# EasyEDA schematic 1-Schematic_DAQ_circuit.json
TITLE: DAQ v2; REV: 1.0; Date: 2024-11-01; Sheet: 1/1; Drawn By: Shadman Shakib; Company: MAIM Lab
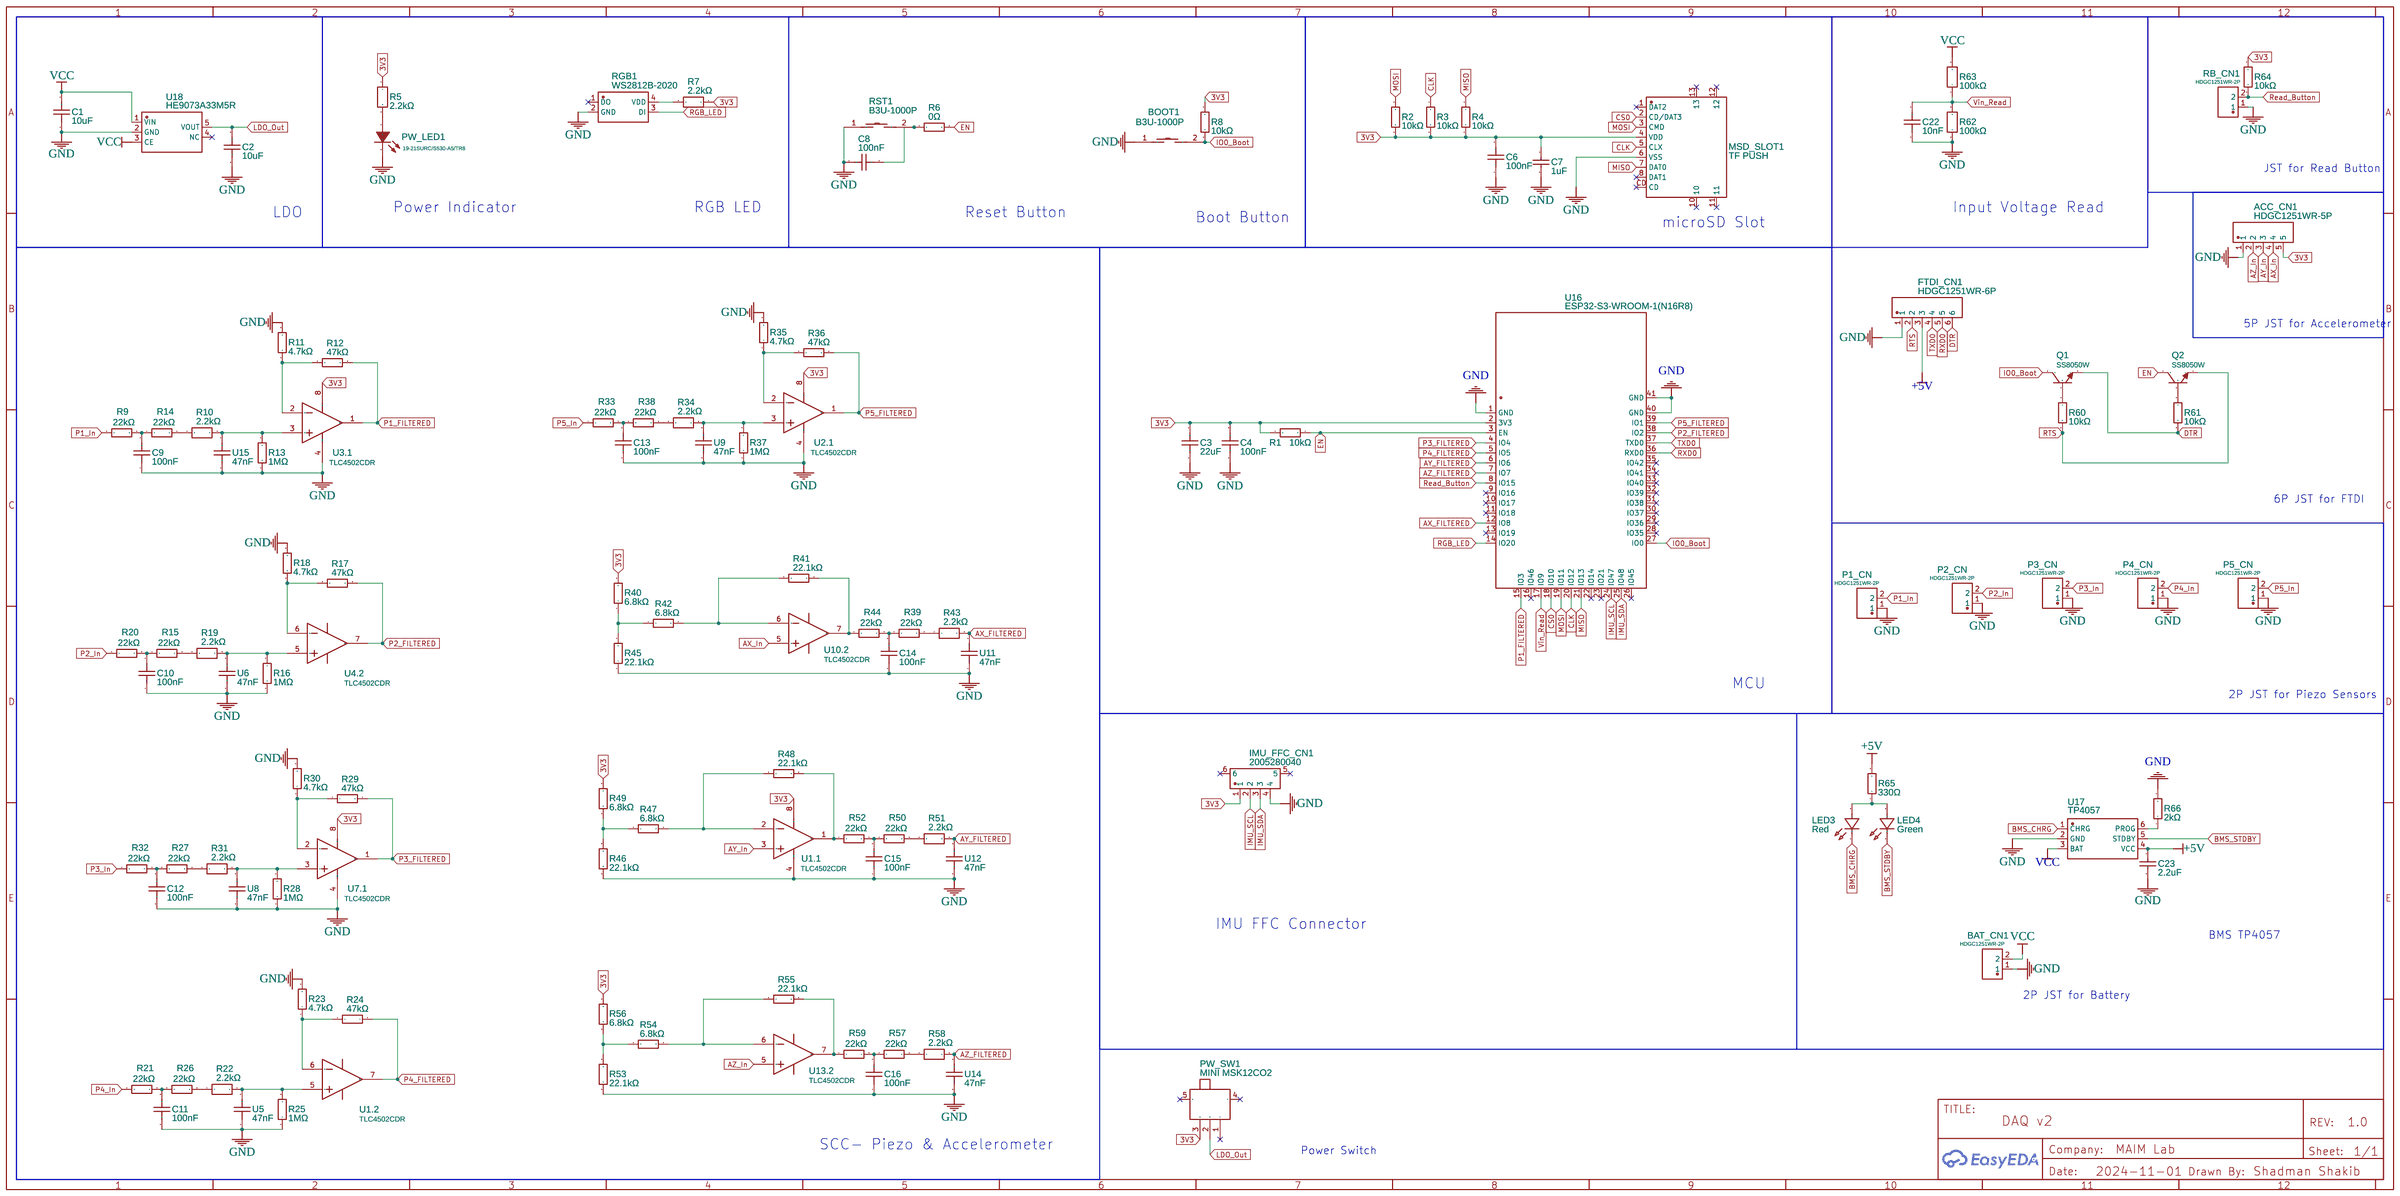
[diagram p0: schematic sheet]

## Parts
ACC_CN1  HDGC1251WR-5P  [CONN-TH_5P-P1.25_HDGC1251WR-5P]
BAT_CN1  HDGC1251WR-2P  [CONN-TH_2P-P1.25_HDGC1251WR-2P]
BOOT1  B3U-1000P  [KEY-SMD_B3U-1000PM]
C1  10uF  [C0402]
C2  10uF  [C0402]
C3  22uF  [C0402]
C4  100nF  [C0402]
C6  100nF  [C0402]
C7  1uF  [C0402]
C8  100nF  [C0402]
C9  100nF  [C0402]
C10  100nF  [C0402]
C11  100nF  [C0402]
C12  100nF  [C0402]
C13  100nF  [C0402]
C14  100nF  [C0402]
C15  100nF  [C0402]
C16  100nF  [C0402]
C22  10nF  [C0402]
C23  2.2uF  [C0402]
FTDI_CN1  HDGC1251WR-6P  [CONN-TH_6P-P1.25_HDGC1251WR-6P]
IMU_FFC_CN1  2005280040  [CONN-SMD_4P-P1.00_2005280040]
LED3  Red  [LED0603-RD_RED]
LED4  Green  [LED0603-RD_GREEN]
MSD_SLOT1  TF PUSH  [TF-SMD_TF-PUSH]
P1_CN  HDGC1251WR-2P  [CONN-TH_2P-P1.25_HDGC1251WR-2P]
P2_CN  HDGC1251WR-2P  [CONN-TH_2P-P1.25_HDGC1251WR-2P]
P3_CN  HDGC1251WR-2P  [CONN-TH_2P-P1.25_HDGC1251WR-2P]
P4_CN  HDGC1251WR-2P  [CONN-TH_2P-P1.25_HDGC1251WR-2P]
P5_CN  HDGC1251WR-2P  [CONN-TH_2P-P1.25_HDGC1251WR-2P]
PW_LED1  19-21SURC/S530-A5/TR8  [LED0603-R-RD_RED]
PW_SW1  MINI MSK12CO2  [SW-SMD_MSK12CO2]
Q1  SS8050W  [SOT-323-3_L2.1-W1.3-P1.30-LS2.3-BR]
Q2  SS8050W  [SOT-323-3_L2.1-W1.3-P1.30-LS2.3-BR]
R1  10kΩ  [R0402]
R2  10kΩ  [R0402]
R3  10kΩ  [R0402]
R4  10kΩ  [R0402]
R5  2.2kΩ  [R0402]
R6  0Ω  [R0402]
R7  2.2kΩ  [R0402]
R8  10kΩ  [R0402]
R9  22kΩ  [R0402]
R10  2.2kΩ  [R0402]
R11  4.7kΩ  [R0402]
R12  47kΩ  [R0402]
R13  1MΩ  [R0402]
R14  22kΩ  [R0402]
R15  22kΩ  [R0402]
R16  1MΩ  [R0402]
R17  47kΩ  [R0402]
R18  4.7kΩ  [R0402]
R19  2.2kΩ  [R0402]
R20  22kΩ  [R0402]
R21  22kΩ  [R0402]
R22  2.2kΩ  [R0402]
R23  4.7kΩ  [R0402]
R24  47kΩ  [R0402]
R25  1MΩ  [R0402]
R26  22kΩ  [R0402]
R27  22kΩ  [R0402]
R28  1MΩ  [R0402]
R29  47kΩ  [R0402]
R30  4.7kΩ  [R0402]
R31  2.2kΩ  [R0402]
R32  22kΩ  [R0402]
R33  22kΩ  [R0402]
R34  2.2kΩ  [R0402]
R35  4.7kΩ  [R0402]
R36  47kΩ  [R0402]
R37  1MΩ  [R0402]
R38  22kΩ  [R0402]
R39  22kΩ  [R0402]
R40  6.8kΩ  [R0402]
R41  22.1kΩ  [R0402]
R42  6.8kΩ  [R0402]
R43  2.2kΩ  [R0402]
R44  22kΩ  [R0402]
R45  22.1kΩ  [R0402]
R46  22.1kΩ  [R0402]
R47  6.8kΩ  [R0402]
R48  22.1kΩ  [R0402]
R49  6.8kΩ  [R0402]
R50  22kΩ  [R0402]
R51  2.2kΩ  [R0402]
R52  22kΩ  [R0402]
R53  22.1kΩ  [R0402]
R54  6.8kΩ  [R0402]
R55  22.1kΩ  [R0402]
R56  6.8kΩ  [R0402]
R57  22kΩ  [R0402]
R58  2.2kΩ  [R0402]
R59  22kΩ  [R0402]
R60  10kΩ  [R0402]
R61  10kΩ  [R0402]
R62  100kΩ  [R0402]
R63  100kΩ  [R0402]
R64  10kΩ  [R0402]
R65  330Ω  [R0402]
R66  2kΩ  [R0402]
RB_CN1  HDGC1251WR-2P  [CONN-TH_2P-P1.25_HDGC1251WR-2P]
RGB1  WS2812B-2020  [LED-SMD_4P-L2.0-W2.0-TL_WS2812B-2020]
RST1  B3U-1000P  [KEY-SMD_B3U-1000PM]
U1  TLC4502CDR  [SOIC-8_L4.9-W3.9-P1.27-LS6.0-BL]  (sections 1,2)
U2  TLC4502CDR  [SOIC-8_L4.9-W3.9-P1.27-LS6.0-BL]  (section 1)
U3  TLC4502CDR  [SOIC-8_L4.9-W3.9-P1.27-LS6.0-BL]  (section 1)
U4  TLC4502CDR  [SOIC-8_L4.9-W3.9-P1.27-LS6.0-BL]  (section 2)
U5  47nF  [C0402]
U6  47nF  [C0402]
U7  TLC4502CDR  [SOIC-8_L4.9-W3.9-P1.27-LS6.0-BL]  (section 1)
U8  47nF  [C0402]
U9  47nF  [C0402]
U10  TLC4502CDR  [SOIC-8_L4.9-W3.9-P1.27-LS6.0-BL]  (section 2)
U11  47nF  [C0402]
U12  47nF  [C0402]
U13  TLC4502CDR  [SOIC-8_L4.9-W3.9-P1.27-LS6.0-BL]  (section 2)
U14  47nF  [C0402]
U15  47nF  [C0402]
U16  ESP32-S3-WROOM-1(N16R8)  [WIRELM-SMD_ESP32-S3-WROOM-1]
U17  TP4057  [SOT-23-6_L2.9-W1.6-P0.95-LS2.8-BR]
U18  HE9073A33M5R  [SOT-23-5_L3.0-W1.7-P0.95-LS2.8-BL]

## Library data of the parts
ACC_CN1 = HDGC1251WR-5P: Contributor: lcsc; Supplier: LCSC; Supplier Part: C5175206; Manufacturer: HDGC(华德共创); JLCPCB Part Class: Extended Part
BAT_CN1 P1_CN P2_CN P3_CN P4_CN P5_CN RB_CN1 = HDGC1251WR-2P: Contributor: lcsc; Supplier: LCSC; Supplier Part: C5175203; Manufacturer: HDGC(华德共创); JLCPCB Part Class: Extended Part
BOOT1 RST1 = B3U-1000P: Contributor: LCSC; Supplier: LCSC; Supplier Part: C231329; Manufacturer: OMRON(欧姆龙); JLCPCB Part Class: Extended Part
C1 C2 = CL05A106MP5NUNC_C315248: Contributor: LCSC; Supplier: LCSC; Supplier Part: C315248; Manufacturer: SAMSUNG(三星); Manufacturer Part: CL05A106MP5NUNC; JLCPCB Part Class: Extended Part
C3 = GRM155R60J226ME11D: Contributor: LCSC; Supplier: LCSC; Supplier Part: C415703; Manufacturer: muRata(村田); JLCPCB Part Class: Extended Part
C4 C6 C8-C16 = CC0402JRX7R7BB104: Contributor: LCSC; Supplier: LCSC; Supplier Part: C541464; Manufacturer: YAGEO(国巨); JLCPCB Part Class: Extended Part
C7 = GRM155R61E105KA12D: Supplier: LCSC; Manufacturer: muRata(村田); Supplier Part: C77009; JLCPCB Part Class: Extended Part
C22 = CC0402KRX7R5BB103: Contributor: LCSC; Supplier: LCSC; Supplier Part: C541370; Manufacturer: YAGEO(国巨); JLCPCB Part Class: Extended Part
C23 = GRM155R61A225KE95D: Supplier: LCSC; Manufacturer: muRata(村田); Supplier Part: C77002; JLCPCB Part Class: Extended Part
FTDI_CN1 = HDGC1251WR-6P: Contributor: lcsc; Supplier: LCSC; Supplier Part: C5175207; Manufacturer: HDGC(华德共创); JLCPCB Part Class: Extended Part
IMU_FFC_CN1 = 2005280040: Supplier: LCSC; Supplier Part: C563728; Manufacturer: MOLEX; JLCPCB Part Class: Extended Part; Contributor: lcsc
LED3 = XL-1608SURC-06: Contributor: LCSC; Supplier: LCSC; Supplier Part: C965799; Manufacturer: XINGLIGHT(成兴光); JLCPCB Part Class: Extended Part
LED4 = 19-219/GHC-YR2T1B5Y/3T: Contributor: lcsc; Supplier: LCSC; Supplier Part: C2994781; Manufacturer: EVERLIGHT(亿光); JLCPCB Part Class: Extended Part
MSD_SLOT1 = TF PUSH: Contributor: LCSC; Supplier: LCSC; Supplier Part: C393941; Manufacturer: SHOU HAN(首韩); JLCPCB Part Class: Extended Part
PW_LED1 = 19-21SURC/S530-A5/TR8: Contributor: LCSC; Supplier: LCSC; Supplier Part: C131269; Manufacturer: EVERLIGHT(亿光); JLCPCB Part Class: Extended Part
PW_SW1 = MINI MSK12CO2: Contributor: LCSC; Supplier: LCSC; Supplier Part: C2681570; Manufacturer: SHOU HAN(首韩); JLCPCB Part Class: Extended Part
Q1 Q2 = SS8050W_C5189252: Contributor: lcsc; Supplier: LCSC; Supplier Part: C5189252; Manufacturer: TWGMC(台湾迪嘉); JLCPCB Part Class: Extended Part
R1-R4 R8 R60 R61 R64 = RC0402FR-0710KL: Supplier: LCSC; Manufacturer: YAGEO(国巨); Supplier Part: C60490; JLCPCB Part Class: Extended Part
R5 R7 = ERA2AEB222X: Contributor: LCSC; Supplier: LCSC; Supplier Part: C445604; Manufacturer: PANASONIC(松下); JLCPCB Part Class: Extended Part
R6 = 0402WGF0000TCE: Supplier: LCSC; Manufacturer: UNI-ROYAL(厚声); Supplier Part: C17168; JLCPCB Part Class: Basic Part
R9 R14 R15 R20 R21 R26 R27 R32 R33 R38 R39 R44 R50 R52 R57 R59 = RT0402BRD0722KL: Contributor: LCSC; Supplier: LCSC; Supplier Part: C326601; Manufacturer: YAGEO(国巨); JLCPCB Part Class: Extended Part
R10 R19 R22 R31 R34 R43 R51 R58 = RT0402BRE072K2L: Contributor: LCSC; Supplier: LCSC; Supplier Part: C705646; Manufacturer: YAGEO(国巨); JLCPCB Part Class: Extended Part
R11 R18 R23 R30 R35 = RC0402FR-074K7L: Supplier: LCSC; Manufacturer: YAGEO(国巨); Supplier Part: C105871; JLCPCB Part Class: Extended Part
R12 R17 R24 R29 R36 = RC0402FR-0747KL: Supplier: LCSC; Manufacturer: YAGEO(国巨); Supplier Part: C93943; JLCPCB Part Class: Extended Part
R13 R16 R25 R28 R37 = RC0402FR-071ML: Supplier: LCSC; Manufacturer: YAGEO(国巨); Supplier Part: C138033; JLCPCB Part Class: Extended Part
R40 R42 R47 R49 R54 R56 = RC0402FR-076K8L: Supplier: LCSC; Manufacturer: YAGEO(国巨); Supplier Part: C93940; JLCPCB Part Class: Extended Part
R41 R45 R46 R48 R53 R55 = RC0402FR-0722K1L: Contributor: LCSC; Supplier: LCSC; Supplier Part: C163478; Manufacturer: YAGEO(国巨); JLCPCB Part Class: Extended Part
R62 R63 = RT0402BRD07100KL: Supplier: LCSC; Supplier Part: C852472; Manufacturer: YAGEO(国巨); JLCPCB Part Class: Extended Part; Contributor: lcsc
R65 = RC0402FR-07330RL: Supplier: LCSC; Manufacturer: YAGEO(国巨); Supplier Part: C105875; JLCPCB Part Class: Extended Part
R66 = RT0402BRD072KL: Contributor: LCSC; Supplier: LCSC; Supplier Part: C852711; Manufacturer: YAGEO(国巨); JLCPCB Part Class: Extended Part
RGB1 = WS2812B-2020: Contributor: LCSC; Supplier: LCSC; Supplier Part: C965555; Manufacturer: worldsemi; JLCPCB Part Class: Extended Part
U1-U4 U7 U10 U13 = TLC4502CDR: subpart_no: 1; Supplier: LCSC; Supplier Part: C2861056; Manufacturer: TI(德州仪器); JLCPCB Part Class: Extended Part
U5 U6 U8 U9 U11 U12 U14 U15 = CC0402JRX7R7BB473: Supplier: LCSC; Supplier Part: C576710; Manufacturer: YAGEO(国巨); JLCPCB Part Class: Extended Part; Contributor: lcsc
U16 = ESP32-S3-WROOM-1(N16R8): Contributor: lcsc; Supplier: LCSC; Supplier Part: C2913202; Manufacturer: ESPRESSIF(乐鑫); Manufacturer Part: ESP32-S3-WROOM-1-N16R8; JLCPCB Part Class: Extended Part
U17 = TP4057_C5380673: Contributor: lcsc; Supplier: LCSC; Supplier Part: C5380673; Manufacturer: TECH PUBLIC(台舟); JLCPCB Part Class: Extended Part
U18 = HE9073A33M5R: Contributor: LCSC; Supplier: LCSC; Supplier Part: C723789; Manufacturer: HEERMICR(赫尔半导体); JLCPCB Part Class: Extended Part

## Nets
3V3: ACC_CN1.5 C3.2 C4.2 C6.2 C7.2 IMU_FFC_CN1.1 MSD_SLOT1.4(VDD) PW_SW1.3 R1.2 R2.2 R3.2 R4.2 R5.1 R7.1 R8.1 R40.2 R49.2 R56.2 R64.1 U1.8(VDD+) U2.8(VDD+) U3.8(VDD+) U7.8(VDD+) U16.2(3V3)
+5V: C23.2 FTDI_CN1.3 R65.2 U17.4(VCC)
GND: ACC_CN1.1 BAT_CN1.1 BOOT1.1 C1.1 C2.1 C3.1 C4.1 C6.1 C7.1 C8.1 C9.1 C10.1 C11.1 C12.1 C13.1 C14.1 C15.1 C16.1 C22.1 C23.1 FTDI_CN1.1 IMU_FFC_CN1.4 MSD_SLOT1.6(VSS) P1_CN.1 P2_CN.1 P3_CN.1 P4_CN.1 P5_CN.1 PW_LED1.2(C) R11.2 R13.1 R16.1 R18.2 R23.2 R25.1 R28.1 R30.2 R35.2 R37.1 R45.1 R46.1 R53.1 R62.1 R66.2 RB_CN1.1 RGB1.2(GND) RST1.1 U1.4(VDD-/GND) U2.4(VDD-/GND) U3.4(VDD-/GND) U5.1 U6.1 U7.4(VDD-/GND) U8.1 U9.1 U11.1 U12.1 U14.1 U15.1 U16.1(GND) U16.40(GND) U16.41(GND) U17.2(GND) U18.2(GND)
VCC: BAT_CN1.2 C1.2 R63.2 U17.3(BAT) U18.1(VIN) U18.3(CE)
Vin_Read: C22.2 R62.2 R63.1 U16.17(IO9)
AX_FILTERED: R43.2 U11.2 U16.12(IO8)
AX_In: ACC_CN1.4 U10.5(2IN+)
AY_FILTERED: R51.2 U12.2 U16.6(IO6)
AY_In: ACC_CN1.3 U1.3(1IN+)
AZ_FILTERED: R58.2 U14.2 U16.7(IO7)
AZ_In: ACC_CN1.2 U13.5(2IN+)
BMS_CHRG: LED3.1(K) U17.1(CHRG)
BMS_STDBY: LED4.1(K) U17.5(STDBY)
CLK: MSD_SLOT1.5(CLX) R3.1 U16.20(IO12)
CS0: MSD_SLOT1.2(CD/DAT3) U16.18(IO10)
DTR: FTDI_CN1.6 Q1.2(E) R61.2
EN: Q2.3(C) R1.1 R6.2 U16.3(EN)
IMU_SCL: IMU_FFC_CN1.2 U16.24(IO47)
IMU_SDA: IMU_FFC_CN1.3 U16.25(IO48)
IO0_Boot: BOOT1.2 Q1.3(C) R8.2 U16.27(IO0)
LDO_Out: C2.2 PW_SW1.2 U18.5(VOUT)
MISO: MSD_SLOT1.7(DAT0) R4.1 U16.21(IO13)
MOSI: MSD_SLOT1.3(CMD) R2.1 U16.19(IO11)
P1_FILTERED: R12.2 U3.1(1OUT) U16.15(IO3)
P1_In: P1_CN.2 R9.1
P2_FILTERED: R17.2 U4.7(2OUT) U16.38(IO2)
P2_In: P2_CN.2 R20.1
P3_FILTERED: R29.2 U7.1(1OUT) U16.4(IO4)
P3_In: P3_CN.2 R32.1
P4_FILTERED: R24.2 U1.7(2OUT) U16.5(IO5)
P4_In: P4_CN.2 R21.1
P5_FILTERED: R36.2 U2.1(1OUT) U16.39(IO1)
P5_In: P5_CN.2 R33.1
Read_Button: R64.2 RB_CN1.2 U16.8(IO15)
RGB_LED: RGB1.3(DI) U16.14(IO20)
RTS: FTDI_CN1.2 Q2.2(E) R60.2
RXD0: FTDI_CN1.5 U16.36(RXD0)
TXD0: FTDI_CN1.4 U16.37(TXD0)
Net-(C8-2): C8.2 R6.1 RST1.2
Net-(C9-2): C9.2 R9.2 R14.1
Net-(C10-2): C10.2 R15.1 R20.2
Net-(C11-2): C11.2 R21.2 R26.1
Net-(C12-2): C12.2 R27.1 R32.2
Net-(C13-2): C13.2 R33.2 R38.1
Net-(C14-2): C14.2 R39.1 R44.2
Net-(C15-2): C15.2 R50.1 R52.2
Net-(C16-2): C16.2 R57.1 R59.2
Net-(LED3-2): LED3.2(A) LED4.2(A) R65.1
Net-(PW_LED1-1): PW_LED1.1(A) R5.2
Net-(Q1-1): Q1.1(B) R60.1
Net-(Q2-1): Q2.1(B) R61.1
Net-(R7-2): R7.2 RGB1.4(VDD)
Net-(R10-1): R10.1 R14.2
Net-(R10-2): R10.2 R13.2 U3.3(1IN+) U15.2
Net-(R11-1): R11.1 R12.1 U3.2(1IN-)
Net-(R15-2): R15.2 R19.1
Net-(R16-2): R16.2 R19.2 U4.5(2IN+) U6.2
Net-(R17-1): R17.1 R18.1 U4.6(2IN-)
Net-(R22-1): R22.1 R26.2
Net-(R22-2): R22.2 R25.2 U1.5(2IN+) U5.2
Net-(R23-1): R23.1 R24.1 U1.6(2IN-)
Net-(R27-2): R27.2 R31.1
Net-(R28-2): R28.2 R31.2 U7.3(1IN+) U8.2
Net-(R29-1): R29.1 R30.1 U7.2(1IN-)
Net-(R34-1): R34.1 R38.2
Net-(R34-2): R34.2 R37.2 U2.3(1IN+) U9.2
Net-(R35-1): R35.1 R36.1 U2.2(1IN-)
Net-(R39-2): R39.2 R43.1
Net-(R40-1): R40.1 R42.1 R45.2
Net-(R41-1): R41.1 R42.2 U10.6(2IN-)
Net-(R41-2): R41.2 R44.1 U10.7(2OUT)
Net-(R46-2): R46.2 R47.1 R49.1
Net-(R47-2): R47.2 R48.1 U1.2(1IN-)
Net-(R48-2): R48.2 R52.1 U1.1(1OUT)
Net-(R50-2): R50.2 R51.1
Net-(R53-2): R53.2 R54.1 R56.1
Net-(R54-2): R54.2 R55.1 U13.6(2IN-)
Net-(R55-2): R55.2 R59.1 U13.7(2OUT)
Net-(R57-2): R57.2 R58.1
Net-(R66-1): R66.1 U17.6(PROG)

Not connected (* = marked no-connect by the designer): IMU_FFC_CN1 5* 6*; MSD_SLOT1 1(DAT2)* 8(DAT1)* 10* 11* 12* 13* CD*; PW_SW1 1* 4* 5*; RGB1 1(DO)*; U16 9(IO16)* 10(IO17)* 11(IO18)* 13(IO19)* 16(IO46)* 22(IO14)* 23(IO21)* 26(IO45)* 28(IO35)* 29(IO36)* 30(IO37)* 31(IO38)* 32(IO39)* 33(IO40)* 34(IO41)* 35(IO42)*; U18 4(NC)*

## Notes on the sheet
- JST for Read Button
- Power Indicator
- RGB LED
- Input Voltage Read
- LDO
- Reset Button
- Boot Button
- microSD Slot
- 5P JST for Accelerometer
- 6P JST for FTDI
- MCU
- 2P JST for Piezo Sensors
- IMU FFC Connector
- BMS TP4057
- 2P JST for Battery
- SCC- Piezo & Accelerometer
- Power Switch
